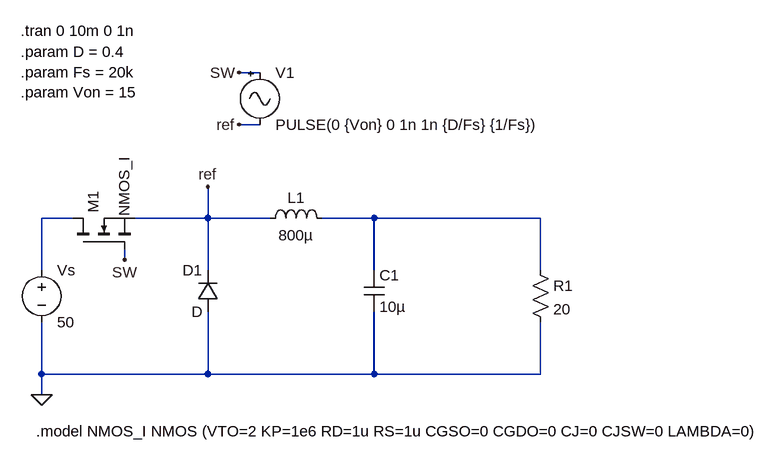
[diagram p0: schematic buck_ideal_20.asc]
buck_ideal_20.asc, the LTspice schematic file:
Version 4.1
SHEET 1 1064 848
WIRE -1264 -848 -1296 -848
WIRE -1264 -768 -1296 -768
WIRE -1552 -624 -1600 -624
WIRE -1344 -624 -1344 -672
WIRE -1344 -624 -1456 -624
WIRE -1248 -624 -1344 -624
WIRE -1088 -624 -1168 -624
WIRE -832 -624 -1088 -624
WIRE -1472 -560 -1472 -576
WIRE -1600 -544 -1600 -624
WIRE -1344 -544 -1344 -624
WIRE -1088 -544 -1088 -624
WIRE -832 -544 -832 -624
WIRE -1600 -384 -1600 -464
WIRE -1344 -384 -1344 -480
WIRE -1344 -384 -1600 -384
WIRE -1088 -384 -1088 -480
WIRE -1088 -384 -1344 -384
WIRE -832 -384 -832 -464
WIRE -832 -384 -1088 -384
WIRE -1600 -352 -1600 -384
FLAG -1296 -848 SW
FLAG -1472 -560 SW
FLAG -1600 -352 0
FLAG -1296 -768 ref
FLAG -1344 -672 ref
SYMBOL voltage -1600 -560 R0
WINDOW 123 0 0 Left 0
WINDOW 39 0 0 Left 0
SYMATTR InstName Vs
SYMATTR Value 50
SYMBOL cap -1104 -544 R0
SYMATTR InstName C1
SYMATTR Value 10µ
SYMBOL res -848 -560 R0
SYMATTR InstName R1
SYMATTR Value 20
SYMBOL nmos -1552 -576 R270
WINDOW 3 50 79 Left 2
SYMATTR Value NMOS_I
SYMATTR InstName M1
SYMBOL diode -1328 -480 R180
WINDOW 0 24 64 Left 2
WINDOW 3 24 0 Left 2
SYMATTR InstName D1
SYMBOL ind -1264 -608 R270
WINDOW 0 32 56 VTop 2
WINDOW 3 5 56 VBottom 2
SYMATTR InstName L1
SYMATTR Value 800µ
SYMATTR SpiceLine Rser=0
SYMBOL Misc\\signal -1264 -864 R0
WINDOW 123 0 0 Left 0
WINDOW 39 0 0 Left 0
SYMATTR InstName V1
SYMATTR Value PULSE(0 {Von} 0 1n 1n {D/Fs} {1/Fs})
TEXT -1632 -912 Left 2 !.tran 0 10m 0 1n
TEXT -1632 -880 Left 2 !.param D = 0.4\n.param Fs = 20k\n.param Von = 15
TEXT -1608 -296 Left 2 !.model NMOS_I NMOS (VTO=2 KP=1e6 RD=1u RS=1u CGSO=0 CGDO=0 CJ=0 CJSW=0 LAMBDA=0)

The netlist it stands for:
* buck_ideal_20.asc
Vs N001 0 50
C1 N002 0 10µ
R1 N002 0 20
M1 N001 SW ref ref NMOS_I
D1 0 ref D
L1 ref N002 800µ Rser=0
V1 SW ref PULSE(0 {Von} 0 1n 1n {D/Fs} {1/Fs})
.model D D
.lib standard.dio
.model NMOS NMOS
.model PMOS PMOS
.lib standard.mos
.tran 0 10m 0 1n
.param D = 0.4
.param Fs = 20k
.param Von = 15
.model NMOS_I NMOS (VTO=2 KP=1e6 RD=1u RS=1u CGSO=0 CGDO=0 CJ=0 CJSW=0 LAMBDA=0)
.backanno
.end